# Altium project ECHO DUAL PT VER DEMO.PrjPcb
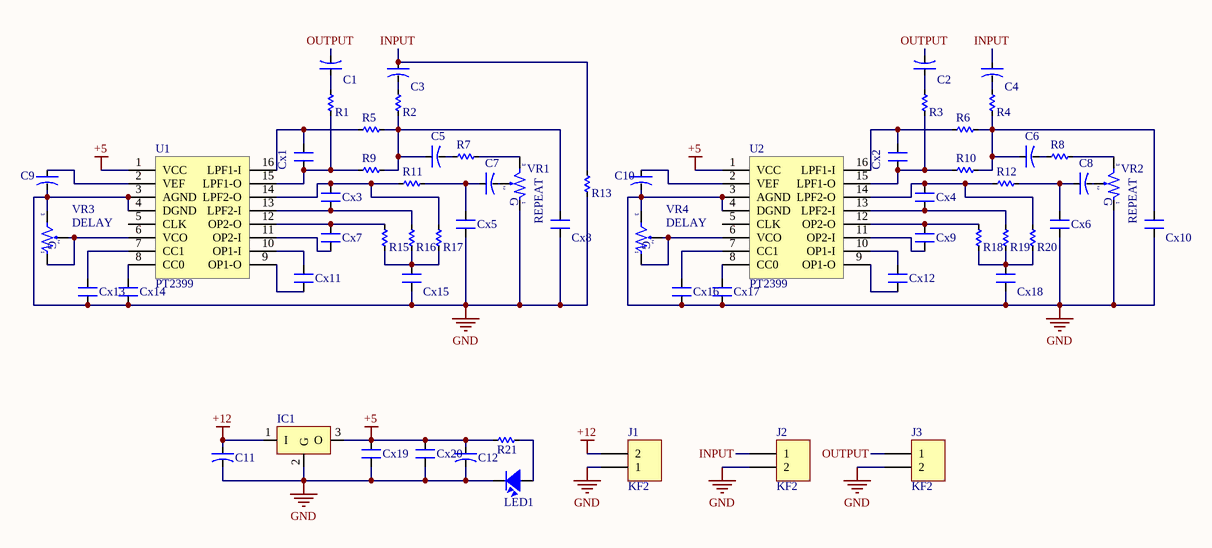
[diagram p0: echo.SchDoc]
1 sheet, 63 parts. Net scope: global (net labels, ports and power ports of the same name join across sheets).
Board file: ech.PcbDoc

## Sheet echo.SchDoc
size A; SheetNumber: 1; SheetTotal: 1

### Parts
C1  CN-ALU-DIP  [CA-ALU-5]  (value not drawn)
C2  CN-ALU-DIP  [CA-ALU-5]  (value not drawn)
C3  CN-ALU-DIP  [CA-ALU-5]  (value not drawn)
C4  CN-ALU-DIP  [CA-ALU-5]  (value not drawn)
C5  CN-ALU-DIP  [CA-ALU-5]  (value not drawn)
C6  CN-ALU-DIP  [CA-ALU-5]  (value not drawn)
C7  CN-ALU-DIP  [CA-ALU-5]  (value not drawn)
C8  CN-ALU-DIP  [CA-ALU-5]  (value not drawn)
C9  CN-ALU-DIP  [CA-ALU-5]  (value not drawn)
C10  CN-ALU-DIP  [CA-ALU-5]  (value not drawn)
C11  CN-ALU-DIP  [CA-ALU-6.3]  (value not drawn)
C12  CN-ALU-DIP  [CA-ALU-8]  (value not drawn)
Cx1  XXpF  [CN1.5]  (value not drawn)
Cx2  XXpF  [CN1.5]  (value not drawn)
Cx3  XXpF  [CN1.5]  (value not drawn)
Cx4  XXpF  [CN1.5]  (value not drawn)
Cx5  XXpF  [CN1.5]  (value not drawn)
Cx6  XXpF  [CN1.5]  (value not drawn)
Cx7  XXpF  [CN1.5]  (value not drawn)
Cx8  XXpF  [CN1.5]  (value not drawn)
Cx9  XXpF  [CN1.5]  (value not drawn)
Cx10  XXpF  [CN1.5]  (value not drawn)
Cx11  XXpF  [CN1.5]  (value not drawn)
Cx12  XXpF  [CN1.5]  (value not drawn)
Cx13  XXpF  [CN1.5]  (value not drawn)
Cx14  XXpF  [CN1.5]  (value not drawn)
Cx15  XXpF  [CN1.5]  (value not drawn)
Cx16  XXpF  [CN1.5]  (value not drawn)
Cx17  XXpF  [CN1.5]  (value not drawn)
Cx18  XXpF  [CN1.5]  (value not drawn)
Cx19  XXpF  [CN1.5]  (value not drawn)
Cx20  XXpF  [CN1.5]  (value not drawn)
IC1  LM78xx  [TO220-123]  (value not drawn)
J1  KF2  [KF2-5.08]
J2  KF2  [KF2-5.08]
J3  KF2  [KF2-5.08]
LED1  LED  [LED-5-BLUE]  (value not drawn)
R1  Res  [RES-1/4W-SMALL]  (value not drawn)
R2  Res  [RES-1/4W-SMALL]  (value not drawn)
R3  Res  [RES-1/4W-SMALL]  (value not drawn)
R4  Res  [RES-1/4W-SMALL]  (value not drawn)
R5  Res  [RES-1/4W-SMALL]  (value not drawn)
R6  Res  [RES-1/4W-SMALL]  (value not drawn)
R7  Res  [RES-1/4W-SMALL]  (value not drawn)
R8  Res  [RES-1/4W-SMALL]  (value not drawn)
R9  Res  [RES-1/4W-SMALL]  (value not drawn)
R10  Res  [RES-1/4W-SMALL]  (value not drawn)
R11  Res  [RES-1/4W-SMALL]  (value not drawn)
R12  Res  [RES-1/4W-SMALL]  (value not drawn)
R13  Res  [RES-1/4W-SMALL]  (value not drawn)
R15  Res  [RES-1/4W-SMALL]  (value not drawn)
R16  Res  [RES-1/4W-SMALL]  (value not drawn)
R17  Res  [RES-1/4W-SMALL]  (value not drawn)
R18  Res  [RES-1/4W-SMALL]  (value not drawn)
R19  Res  [RES-1/4W-SMALL]  (value not drawn)
R20  Res  [RES-1/4W-SMALL]  (value not drawn)
R21  Res  [RES-1/4W-SMALL]  (value not drawn)
U1  PT2399  [DIP16]
U2  PT2399  [DIP16]
VR1  REPEAT  [VR-S1]
VR2  REPEAT  [VR-S1]
VR3  DELAY  [VR-S1]
VR4  DELAY  [VR-S1]

### Nets
+5: C12.1 Cx19.2 Cx20.2 IC1.3(O) R21.1 U1.1(VCC) U2.1(VCC)
+12: C11.1 IC1.1(I) J1.2
GND: C9.2 C10.2 C11.2 C12.2 Cx5.2 Cx6.2 Cx8.2 Cx10.2 Cx13.2 Cx14.2 Cx15.2 Cx16.2 Cx17.2 Cx18.2 Cx19.1 Cx20.1 IC1.2(G) J1.1 J2.2 J3.2 LED1.2 R13.1 U1.3(AGND) U1.4(DGND) U2.3(AGND) U2.4(DGND) VR1.1 VR2.1 VR3.3 VR4.3
INPUT: C3.1 C4.1 J2.1 R13.2
OUTPUT: C1.2 C2.2 J3.1
NetC1_1: C1.1 R1.1
NetC2_1: C2.1 R3.1
NetC3_2: C3.2 R2.2
NetC4_2: C4.2 R4.2
NetC5_1: C5.1 Cx8.1 R2.1 R5.1 R9.1
NetC5_2: C5.2 R7.2
NetC6_1: C6.1 Cx10.1 R4.1 R6.1 R10.1
NetC6_2: C6.2 R8.2
NetC7_1: C7.1 Cx5.1 R11.1
NetC7_2: C7.2 VR1.2
NetC8_1: C8.1 Cx6.1 R12.1
NetC8_2: C8.2 VR2.2
NetC9_1: C9.1 U1.2(VEF)
NetC10_1: C10.1 U2.2(VEF)
NetCx1_1: Cx1.1 R5.2 U1.16(LPF1-I)
NetCx1_2: Cx1.2 R1.2 R9.2 U1.15(LPF1-O)
NetCx2_1: Cx2.1 R6.2 U2.16(LPF1-I)
NetCx2_2: Cx2.2 R3.2 R10.2 U2.15(LPF1-O)
NetCx3_1: Cx3.1 R11.2 R17.1 U1.14(LPF2-O)
NetCx3_2: Cx3.2 R16.1 U1.13(LPF2-I)
NetCx4_1: Cx4.1 R12.2 R20.1 U2.14(LPF2-O)
NetCx4_2: Cx4.2 R19.1 U2.13(LPF2-I)
NetCx7_1: Cx7.1 R15.1 U1.12(OP2-O)
NetCx7_2: Cx7.2 U1.11(OP2-I)
NetCx9_1: Cx9.1 R18.1 U2.12(OP2-O)
NetCx9_2: Cx9.2 U2.11(OP2-I)
NetCx11_1: Cx11.1 U1.10(OP1-I)
NetCx11_2: Cx11.2 U1.9(OP1-O)
NetCx12_1: Cx12.1 U2.10(OP1-I)
NetCx12_2: Cx12.2 U2.9(OP1-O)
NetCx13_1: Cx13.1 U1.7(CC1)
NetCx14_1: Cx14.1 U1.8(CC0)
NetCx15_1: Cx15.1 R15.2 R16.2 R17.2
NetCx16_1: Cx16.1 U2.7(CC1)
NetCx17_1: Cx17.1 U2.8(CC0)
NetCx18_1: Cx18.1 R18.2 R19.2 R20.2
NetLED1_1: LED1.1 R21.2
NetR7_1: R7.1 VR1.3
NetR8_1: R8.1 VR2.3
NetU1_6: U1.6(VCO) VR3.1 VR3.2
NetU2_6: U2.6(VCO) VR4.1 VR4.2

Not connected (* = marked no-connect by the designer): U1 5(CLK); U2 5(CLK)

### Notes on the sheet
- (in symbol VR-S) G

### Library data of the parts
C1-C12 = CN-ALU-DIP: Capacitor (Semiconductor SIM Model); Value: 104; LatestRevisionDate: 17-Jul-2002; LatestRevisionNote: Re-released for DXP Platform.; PackageReference: C1206; Publisher: Altium Limited
Cx1-Cx20 = CN: Value: 33pF
IC1 = LM78xx: Positive Voltage Regulator; Note: Tab is connected to pin 3 (GND).; Published: 24-Aug-2001; LatestRevisionDate: 17-Jul-2002; LatestRevisionNote: Re-released for DXP Platform.; DatasheetVersion: Apr-1994; PackageVersion: Jul-1998; PackageReference: ISOWATT220AB; Publisher: Altium Limited; PackageDescription: TO, Thru-Hole, Vertical, Heatsink Mounted; 3 In-Line Leads; Pitch 2.54 mm; Pin sequence 1, 3, 2; ComponentLink1Description: Manufacturer Link; ComponentLink1URL: http://www.st.com/; ComponentLink2Description: Datasheet; ComponentLink2URL: http://www.st.com/stonline/products/literature/ds/2146/l78m05c.pdf
J1-J3 = KF2: Manufacturer: Würth Elektronik eiSos GmbH; partNo: 691103110002; ComponentLink1 Description: Manufacturer; ComponentLink2 Description: Datasheet; NoPins: 2; Created Date: 29 October 2013; ComponentLink1URL: http://www.we-online.com; ComponentLink2URL: http://katalog.we-online.de/em/datasheet/6911031100xx.pdf; Created by: Karrer Zheng
LED1 = LED: LED Single colour Green and Red; Value: LED 3 ly Single Colour
R1-R13 R15-R21 = Res: Manufacturer: Generic Components; Class: Passive; SubClass: R; Published: 08/06/2000; Publisher: Altium Hobart Technology Centre
U1 U2 = PT2399: Reverb
VR1-VR4 = VR-S: Var Resistor; Value: Volume 50k